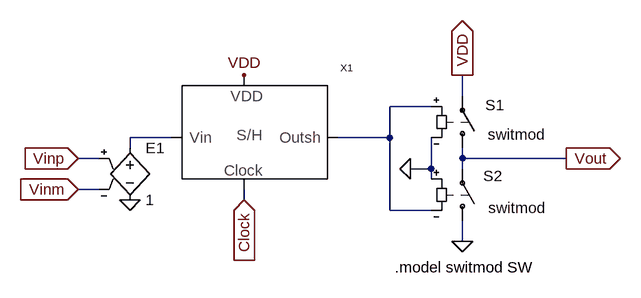
[diagram p0: schematic Ideal_clocked_comparator.asc]
Ideal_clocked_comparator.asc, the LTspice schematic file:
Version 4
SHEET 1 6308 700
WIRE 1472 -176 1472 -208
WIRE 1424 -160 1360 -160
WIRE 1024 -112 960 -112
WIRE 1360 -112 1360 -160
WIRE 1360 -112 1280 -112
WIRE 960 -96 960 -112
WIRE 912 -80 880 -80
WIRE 1472 -80 1472 -96
WIRE 1632 -80 1472 -80
WIRE 1424 -64 1424 -112
WIRE 1424 -64 1392 -64
WIRE 1472 -64 1472 -80
WIRE 1424 -48 1424 -64
WIRE 912 -32 880 -32
WIRE 1136 -16 1136 -32
WIRE 1360 0 1360 -112
WIRE 1424 0 1360 0
WIRE 1472 48 1472 16
FLAG 1632 -80 Vout
IOPIN 1632 -80 Out
FLAG 1472 -208 VDD
IOPIN 1472 -208 Out
FLAG 1472 48 0
FLAG 880 -80 Vinp
IOPIN 880 -80 In
FLAG 1136 -16 Clock
IOPIN 1136 -16 In
FLAG 880 -32 Vinm
IOPIN 880 -32 In
FLAG 1136 -208 VDD
FLAG 1392 -64 0
FLAG 960 -16 0
SYMBOL sw 1472 -80 M180
WINDOW 3 24 -12 Left 0
WINDOW 38 39 37 Left 0
WINDOW 0 35 82 Left 0
SYMATTR Value ""
SYMATTR SpiceModel switmod
SYMATTR InstName S1
SYMBOL sw 1472 32 M180
WINDOW 3 24 -12 Left 0
WINDOW 38 40 36 Left 0
WINDOW 0 32 85 Left 0
SYMATTR Value ""
SYMATTR SpiceModel switmod
SYMATTR InstName S2
SYMBOL Sample_and_hold 1040 -48 R0
SYMATTR InstName X1
SYMBOL e 960 -112 R0
SYMATTR InstName E1
SYMATTR Value 1
TEXT 1368 88 Left 0 !.model switmod SW

The netlist it stands for:
* Ideal_clocked_comparator.asc
S1 Vout VDD N001 0 switmod
S2 0 Vout 0 N001 switmod
XX1 N002 N001 Clock VDD Sample_and_hold  ; pins Vin Outsh Clock VDD
E1 N002 0 Vinp Vinm 1
.model switmod SW
.backanno
.end